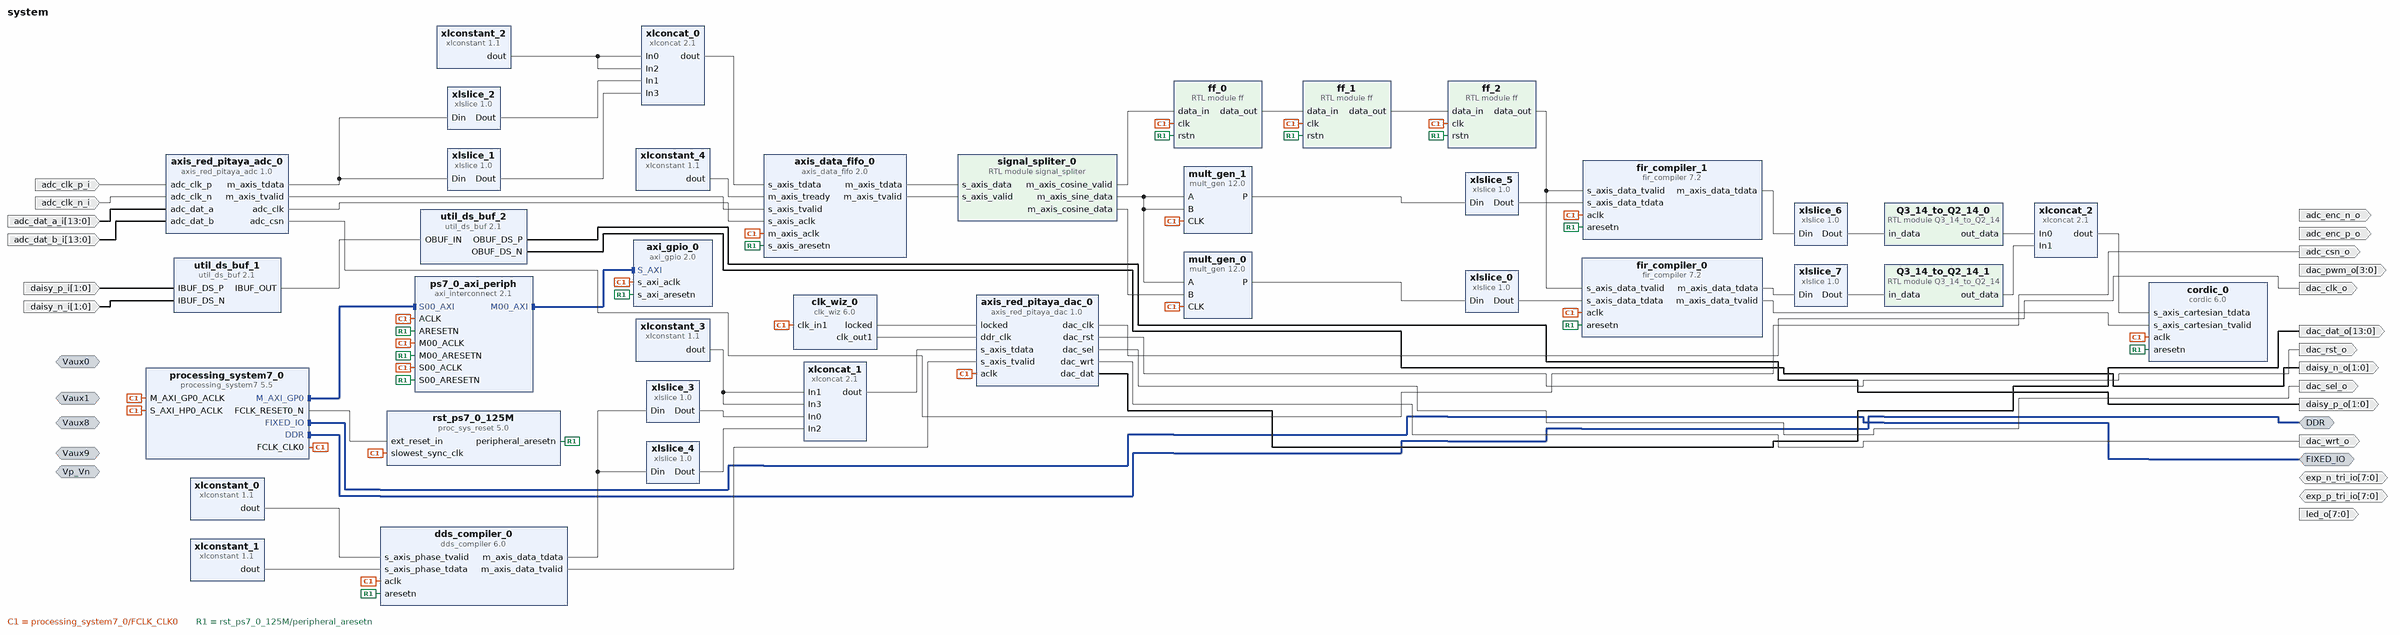
[diagram p0: block diagram of the top level]
# Vivado block design system, xc7z010clg400-1, Vivado 2020.1
create_bd_design system

create_bd_intf_port -mode Slave -vlnv xilinx.com:interface:diff_analog_io_rtl:1.0 Vp_Vn
create_bd_intf_port -mode Slave -vlnv xilinx.com:interface:diff_analog_io_rtl:1.0 Vaux0
create_bd_intf_port -mode Slave -vlnv xilinx.com:interface:diff_analog_io_rtl:1.0 Vaux1
create_bd_intf_port -mode Slave -vlnv xilinx.com:interface:diff_analog_io_rtl:1.0 Vaux9
create_bd_intf_port -mode Slave -vlnv xilinx.com:interface:diff_analog_io_rtl:1.0 Vaux8
create_bd_intf_port -mode Master -vlnv xilinx.com:interface:ddrx_rtl:1.0 DDR
create_bd_intf_port -mode Master -vlnv xilinx.com:display_processing_system7:fixedio_rtl:1.0 FIXED_IO
create_bd_port -dir I -from 13 -to 0 adc_dat_a_i
create_bd_port -dir I -from 13 -to 0 adc_dat_b_i
create_bd_port -dir I adc_clk_p_i
create_bd_port -dir I adc_clk_n_i
create_bd_port -dir O adc_enc_p_o
create_bd_port -dir O adc_enc_n_o
create_bd_port -dir O adc_csn_o
create_bd_port -dir O -from 13 -to 0 dac_dat_o
create_bd_port -dir O dac_clk_o
create_bd_port -dir O dac_rst_o
create_bd_port -dir O dac_sel_o
create_bd_port -dir O dac_wrt_o
create_bd_port -dir O -from 3 -to 0 dac_pwm_o
create_bd_port -dir IO -from 7 -to 0 exp_p_tri_io
create_bd_port -dir IO -from 7 -to 0 exp_n_tri_io
create_bd_port -dir O -from 1 -to 0 daisy_p_o
create_bd_port -dir O -from 1 -to 0 daisy_n_o
create_bd_port -dir I -from 1 -to 0 daisy_p_i
create_bd_port -dir I -from 1 -to 0 daisy_n_i
create_bd_port -dir O -from 7 -to 0 led_o

create_bd_cell -type ip -vlnv xilinx.com:ip:processing_system7:5.5 processing_system7_0
set_property -dict [list \
  CONFIG.PCW_APU_PERIPHERAL_FREQMHZ 666.666666 \
  CONFIG.PCW_ENET0_ENET0_IO {MIO 16 .. 27} \
  CONFIG.PCW_ENET0_GRP_MDIO_ENABLE 1 \
  CONFIG.PCW_ENET0_GRP_MDIO_IO EMIO \
  CONFIG.PCW_ENET0_PERIPHERAL_ENABLE 1 \
  CONFIG.PCW_ENET0_RESET_ENABLE 0 \
  CONFIG.PCW_ENET_RESET_ENABLE 1 \
  CONFIG.PCW_ENET_RESET_SELECT {Share reset pin} \
  CONFIG.PCW_FPGA0_PERIPHERAL_FREQMHZ 125 \
  CONFIG.PCW_FPGA1_PERIPHERAL_FREQMHZ 250 \
  CONFIG.PCW_FPGA3_PERIPHERAL_FREQMHZ 200 \
  CONFIG.PCW_GPIO_MIO_GPIO_ENABLE 1 \
  CONFIG.PCW_GPIO_MIO_GPIO_IO MIO \
  CONFIG.PCW_GPIO_PERIPHERAL_ENABLE 1 \
  CONFIG.PCW_I2C0_GRP_INT_ENABLE 0 \
  CONFIG.PCW_I2C0_I2C0_IO {MIO 50 .. 51} \
  CONFIG.PCW_I2C0_PERIPHERAL_ENABLE 1 \
  CONFIG.PCW_I2C_PERIPHERAL_FREQMHZ 111.111115 \
  CONFIG.PCW_I2C_RESET_ENABLE 1 \
  CONFIG.PCW_I2C_RESET_SELECT {Share reset pin} \
  CONFIG.PCW_IMPORT_BOARD_PRESET cfg/red_pitaya.xml \
  CONFIG.PCW_PRESET_BANK1_VOLTAGE {LVCMOS 2.5V} \
  CONFIG.PCW_QSPI_GRP_SINGLE_SS_ENABLE 1 \
  CONFIG.PCW_QSPI_GRP_SINGLE_SS_IO {MIO 1 .. 6} \
  CONFIG.PCW_QSPI_PERIPHERAL_ENABLE 1 \
  CONFIG.PCW_QSPI_PERIPHERAL_FREQMHZ 125 \
  CONFIG.PCW_QSPI_QSPI_IO {MIO 1 .. 6} \
  CONFIG.PCW_SD0_GRP_CD_ENABLE 1 \
  CONFIG.PCW_SD0_GRP_CD_IO {MIO 46} \
  CONFIG.PCW_SD0_GRP_WP_ENABLE 1 \
  CONFIG.PCW_SD0_GRP_WP_IO {MIO 47} \
  CONFIG.PCW_SD0_PERIPHERAL_ENABLE 1 \
  CONFIG.PCW_SD0_SD0_IO {MIO 40 .. 45} \
  CONFIG.PCW_SDIO_PERIPHERAL_FREQMHZ 100 \
  CONFIG.PCW_SINGLE_QSPI_DATA_MODE x4 \
  CONFIG.PCW_SPI0_PERIPHERAL_ENABLE 1 \
  CONFIG.PCW_SPI0_SPI0_IO EMIO \
  CONFIG.PCW_SPI1_PERIPHERAL_ENABLE 1 \
  CONFIG.PCW_SPI1_SPI1_IO {MIO 10 .. 15} \
  CONFIG.PCW_TTC0_PERIPHERAL_ENABLE 1 \
  CONFIG.PCW_TTC0_TTC0_IO EMIO \
  CONFIG.PCW_UART0_PERIPHERAL_ENABLE 1 \
  CONFIG.PCW_UART0_UART0_IO {MIO 14 .. 15} \
  CONFIG.PCW_UART1_PERIPHERAL_ENABLE 1 \
  CONFIG.PCW_UART1_UART1_IO {MIO 8 .. 9} \
  CONFIG.PCW_UART_PERIPHERAL_FREQMHZ 100 \
  CONFIG.PCW_UIPARAM_DDR_BUS_WIDTH {16 Bit} \
  CONFIG.PCW_UIPARAM_DDR_FREQ_MHZ 533.333333 \
  CONFIG.PCW_UIPARAM_DDR_PARTNO {MT41J256M16 RE-125} \
  CONFIG.PCW_USB0_PERIPHERAL_ENABLE 1 \
  CONFIG.PCW_USB0_RESET_ENABLE 1 \
  CONFIG.PCW_USB0_RESET_IO {MIO 48} \
  CONFIG.PCW_USB0_USB0_IO {MIO 28 .. 39} \
  CONFIG.PCW_USB_RESET_ENABLE 1 \
  CONFIG.PCW_USB_RESET_SELECT {Share reset pin} \
  CONFIG.PCW_USE_S_AXI_HP0 1 \
] [get_bd_cells processing_system7_0]
# 429 more settings of processing_system7_0 are not shown: defaults, MIO pin electricals, DDR timing, and values the tool derives
create_bd_cell -type ip -vlnv xilinx.com:ip:util_ds_buf:2.1 util_ds_buf_1
set_property -dict {CONFIG.C_SIZE 2} [get_bd_cells util_ds_buf_1]
create_bd_cell -type ip -vlnv xilinx.com:ip:util_ds_buf:2.1 util_ds_buf_2
set_property -dict {CONFIG.C_BUF_TYPE OBUFDS CONFIG.C_SIZE 2} [get_bd_cells util_ds_buf_2]
create_bd_cell -type ip -vlnv xilinx.com:ip:axi_gpio:2.0 axi_gpio_0
set_property -dict [list \
  CONFIG.C_ALL_INPUTS_2 1 \
  CONFIG.C_ALL_OUTPUTS 1 \
  CONFIG.C_GPIO_WIDTH 16 \
  CONFIG.C_IS_DUAL 1 \
] [get_bd_cells axi_gpio_0]
create_bd_cell -type ip -vlnv pavel-demin:user:axis_red_pitaya_adc:1.0 axis_red_pitaya_adc_0
create_bd_cell -type ip -vlnv pavel-demin:user:axis_red_pitaya_dac:1.0 axis_red_pitaya_dac_0
create_bd_cell -type ip -vlnv xilinx.com:ip:clk_wiz:6.0 clk_wiz_0
set_property -dict [list \
  CONFIG.CLKIN1_JITTER_PS 80.0 \
  CONFIG.CLKOUT1_JITTER 104.759 \
  CONFIG.CLKOUT1_PHASE_ERROR 96.948 \
  CONFIG.CLKOUT1_REQUESTED_OUT_FREQ 250.000 \
  CONFIG.MMCM_CLKFBOUT_MULT_F 8.000 \
  CONFIG.MMCM_CLKIN1_PERIOD 8.000 \
  CONFIG.MMCM_CLKOUT0_DIVIDE_F 4.000 \
  CONFIG.MMCM_DIVCLK_DIVIDE 1 \
  CONFIG.PRIM_IN_FREQ 125.000 \
  CONFIG.USE_RESET false \
] [get_bd_cells clk_wiz_0]
create_bd_cell -type ip -vlnv xilinx.com:ip:dds_compiler:6.0 dds_compiler_0
set_property -dict [list \
  CONFIG.Amplitude_Mode Full_Range \
  CONFIG.DATA_Has_TLAST Not_Required \
  CONFIG.DDS_Clock_Rate 125 \
  CONFIG.Frequency_Resolution 0.5 \
  CONFIG.Has_ACLKEN false \
  CONFIG.Has_ARESETn true \
  CONFIG.Has_Phase_Out false \
  CONFIG.Latency 7 \
  CONFIG.M_DATA_Has_TUSER Not_Required \
  CONFIG.Noise_Shaping None \
  CONFIG.Output_Frequency1 0 \
  CONFIG.Output_Width 16 \
  CONFIG.PINC1 0 \
  CONFIG.Parameter_Entry Hardware_Parameters \
  CONFIG.PartsPresent Phase_Generator_and_SIN_COS_LUT \
  CONFIG.Phase_Increment Streaming \
  CONFIG.Phase_Width 16 \
  CONFIG.S_PHASE_Has_TUSER Not_Required \
  CONFIG.Spurious_Free_Dynamic_Range 84 \
] [get_bd_cells dds_compiler_0]
create_bd_cell -type ip -vlnv xilinx.com:ip:axi_interconnect:2.1 ps7_0_axi_periph
set_property -dict {CONFIG.NUM_MI 1} [get_bd_cells ps7_0_axi_periph]
create_bd_cell -type ip -vlnv xilinx.com:ip:proc_sys_reset:5.0 rst_ps7_0_125M
create_bd_cell -type ip -vlnv xilinx.com:ip:xlconstant:1.1 xlconstant_0
create_bd_cell -type ip -vlnv xilinx.com:ip:xlconstant:1.1 xlconstant_1
set_property -dict {CONFIG.CONST_VAL 524 CONFIG.CONST_WIDTH 16} [get_bd_cells xlconstant_1]
create_bd_cell -type module -reference signal_spliter signal_spliter_0
create_bd_cell -type ip -vlnv xilinx.com:ip:fir_compiler:7.2 fir_compiler_0
set_property -dict [list \
  CONFIG.Channel_Sequence Basic \
  CONFIG.Clock_Frequency 125 \
  CONFIG.CoefficientVector {-0.036879, 0.014709, 0.012419, 0.010714, 0.009481, 0.008588, 0.007977, 0.007579, 0.007363, 0.007260, 0.007271, 0.007359, 0.007498, 0.007690, 0.007919, 0.008172, 0.008453, 0.008745, 0.009054, 0.009364, 0.009690, 0.010011, 0.010340, 0.010664, 0.010988, 0.011300, 0.011615, 0.011917, 0.012221, 0.012515, 0.012810, 0.013089, 0.013361, 0.013616, 0.013858, 0.014084, 0.014309, 0.014512, 0.014717, 0.014903, 0.015075, 0.015222, 0.015355, 0.015478, 0.015558, 0.015693, 0.015748, 0.015798, 0.015861, 0.015870, 0.015873, 0.015870, 0.015861, 0.015798, 0.015748, 0.015693, 0.015558, 0.015478, 0.015355, 0.015222, 0.015075, 0.014903, 0.014717, 0.014512, 0.014309, 0.014084, 0.013858, 0.013616, 0.013361, 0.013089, 0.012810, 0.012515, 0.012221, 0.011917, 0.011615, 0.011300, 0.010988, 0.010664, 0.010340, 0.010011, 0.009690, 0.009364, 0.009054, 0.008745, 0.008453, 0.008172, 0.007919, 0.007690, 0.007498, 0.007359, 0.007271, 0.007260, 0.007363, 0.007579, 0.007977, 0.008588, 0.009481, 0.010714, 0.012419, 0.014709, -0.036879} \
  CONFIG.Coefficient_Fractional_Bits 19 \
  CONFIG.Coefficient_Sets 1 \
  CONFIG.Coefficient_Sign Signed \
  CONFIG.Coefficient_Structure Inferred \
  CONFIG.Coefficient_Width 16 \
  CONFIG.ColumnConfig 40,11 \
  CONFIG.DATA_Has_TLAST Not_Required \
  CONFIG.Data_Fractional_Bits 14 \
  CONFIG.Data_Sign Signed \
  CONFIG.Data_Width 16 \
  CONFIG.Filter_Architecture Systolic_Multiply_Accumulate \
  CONFIG.Has_ARESETn true \
  CONFIG.M_DATA_Has_TUSER Not_Required \
  CONFIG.Number_Channels 1 \
  CONFIG.Output_Rounding_Mode Full_Precision \
  CONFIG.Output_Width 36 \
  CONFIG.Quantization Quantize_Only \
  CONFIG.S_DATA_Has_TUSER Not_Required \
  CONFIG.Sample_Frequency 125 \
  CONFIG.Select_Pattern All \
] [get_bd_cells fir_compiler_0]
create_bd_cell -type ip -vlnv xilinx.com:ip:xlslice:1.0 xlslice_0
set_property -dict {CONFIG.DIN_FROM 31 CONFIG.DIN_TO 16 CONFIG.DIN_WIDTH 32 CONFIG.DOUT_WIDTH 16} [get_bd_cells xlslice_0]
create_bd_cell -type ip -vlnv xilinx.com:ip:axis_data_fifo:2.0 axis_data_fifo_0
set_property -dict [list \
  CONFIG.FIFO_DEPTH 16 \
  CONFIG.HAS_RD_DATA_COUNT 1 \
  CONFIG.HAS_WR_DATA_COUNT 1 \
  CONFIG.IS_ACLK_ASYNC 1 \
  CONFIG.SYNCHRONIZATION_STAGES 2 \
  CONFIG.TDATA_NUM_BYTES 4 \
] [get_bd_cells axis_data_fifo_0]
create_bd_cell -type ip -vlnv xilinx.com:ip:mult_gen:12.0 mult_gen_0
set_property -dict [list \
  CONFIG.Multiplier_Construction Use_Mults \
  CONFIG.OutputWidthHigh 31 \
  CONFIG.PipeStages 3 \
  CONFIG.PortAType Signed \
  CONFIG.PortAWidth 16 \
  CONFIG.PortBType Signed \
  CONFIG.PortBWidth 16 \
  CONFIG.Use_Custom_Output_Width true \
] [get_bd_cells mult_gen_0]
create_bd_cell -type module -reference ff ff_0
create_bd_cell -type module -reference ff ff_1
create_bd_cell -type module -reference ff ff_2
create_bd_cell -type ip -vlnv xilinx.com:ip:xlslice:1.0 xlslice_1
set_property -dict {CONFIG.DIN_FROM 29 CONFIG.DIN_TO 16 CONFIG.DOUT_WIDTH 14} [get_bd_cells xlslice_1]
create_bd_cell -type ip -vlnv xilinx.com:ip:xlslice:1.0 xlslice_2
set_property -dict {CONFIG.DIN_FROM 13 CONFIG.DIN_TO 0 CONFIG.DOUT_WIDTH 14} [get_bd_cells xlslice_2]
create_bd_cell -type ip -vlnv xilinx.com:ip:xlconstant:1.1 xlconstant_2
set_property -dict {CONFIG.CONST_VAL 0 CONFIG.CONST_WIDTH 2} [get_bd_cells xlconstant_2]
create_bd_cell -type ip -vlnv xilinx.com:ip:xlconcat:2.1 xlconcat_0
set_property -dict [list \
  CONFIG.IN0_WIDTH 2 \
  CONFIG.IN1_WIDTH 14 \
  CONFIG.IN2_WIDTH 2 \
  CONFIG.IN3_WIDTH 14 \
  CONFIG.NUM_PORTS 4 \
] [get_bd_cells xlconcat_0]
create_bd_cell -type ip -vlnv xilinx.com:ip:xlslice:1.0 xlslice_3
set_property -dict {CONFIG.DIN_FROM 15 CONFIG.DIN_TO 2 CONFIG.DOUT_WIDTH 14} [get_bd_cells xlslice_3]
create_bd_cell -type ip -vlnv xilinx.com:ip:xlconstant:1.1 xlconstant_3
set_property -dict {CONFIG.CONST_VAL 0 CONFIG.CONST_WIDTH 2} [get_bd_cells xlconstant_3]
create_bd_cell -type ip -vlnv xilinx.com:ip:xlslice:1.0 xlslice_4
set_property -dict {CONFIG.DIN_FROM 31 CONFIG.DIN_TO 18 CONFIG.DOUT_WIDTH 14} [get_bd_cells xlslice_4]
create_bd_cell -type ip -vlnv xilinx.com:ip:xlconcat:2.1 xlconcat_1
set_property -dict [list \
  CONFIG.IN0_WIDTH 14 \
  CONFIG.IN1_WIDTH 2 \
  CONFIG.IN2_WIDTH 14 \
  CONFIG.IN3_WIDTH 2 \
  CONFIG.NUM_PORTS 4 \
] [get_bd_cells xlconcat_1]
create_bd_cell -type ip -vlnv xilinx.com:ip:mult_gen:12.0 mult_gen_1
set_property -dict [list \
  CONFIG.Multiplier_Construction Use_Mults \
  CONFIG.OutputWidthHigh 31 \
  CONFIG.PipeStages 3 \
  CONFIG.PortAType Signed \
  CONFIG.PortAWidth 16 \
  CONFIG.PortBType Signed \
  CONFIG.PortBWidth 16 \
  CONFIG.Use_Custom_Output_Width true \
] [get_bd_cells mult_gen_1]
create_bd_cell -type ip -vlnv xilinx.com:ip:fir_compiler:7.2 fir_compiler_1
set_property -dict [list \
  CONFIG.Channel_Sequence Basic \
  CONFIG.Clock_Frequency 125 \
  CONFIG.CoefficientVector {-0.036879, 0.014709, 0.012419, 0.010714, 0.009481, 0.008588, 0.007977, 0.007579, 0.007363, 0.007260, 0.007271, 0.007359, 0.007498, 0.007690, 0.007919, 0.008172, 0.008453, 0.008745, 0.009054, 0.009364, 0.009690, 0.010011, 0.010340, 0.010664, 0.010988, 0.011300, 0.011615, 0.011917, 0.012221, 0.012515, 0.012810, 0.013089, 0.013361, 0.013616, 0.013858, 0.014084, 0.014309, 0.014512, 0.014717, 0.014903, 0.015075, 0.015222, 0.015355, 0.015478, 0.015558, 0.015693, 0.015748, 0.015798, 0.015861, 0.015870, 0.015873, 0.015870, 0.015861, 0.015798, 0.015748, 0.015693, 0.015558, 0.015478, 0.015355, 0.015222, 0.015075, 0.014903, 0.014717, 0.014512, 0.014309, 0.014084, 0.013858, 0.013616, 0.013361, 0.013089, 0.012810, 0.012515, 0.012221, 0.011917, 0.011615, 0.011300, 0.010988, 0.010664, 0.010340, 0.010011, 0.009690, 0.009364, 0.009054, 0.008745, 0.008453, 0.008172, 0.007919, 0.007690, 0.007498, 0.007359, 0.007271, 0.007260, 0.007363, 0.007579, 0.007977, 0.008588, 0.009481, 0.010714, 0.012419, 0.014709, -0.036879} \
  CONFIG.Coefficient_Fractional_Bits 19 \
  CONFIG.Coefficient_Sets 1 \
  CONFIG.Coefficient_Sign Signed \
  CONFIG.Coefficient_Structure Inferred \
  CONFIG.Coefficient_Width 16 \
  CONFIG.ColumnConfig 40,11 \
  CONFIG.DATA_Has_TLAST Not_Required \
  CONFIG.Data_Fractional_Bits 14 \
  CONFIG.Data_Sign Signed \
  CONFIG.Data_Width 16 \
  CONFIG.Filter_Architecture Systolic_Multiply_Accumulate \
  CONFIG.Has_ARESETn true \
  CONFIG.M_DATA_Has_TUSER Not_Required \
  CONFIG.Number_Channels 1 \
  CONFIG.Output_Rounding_Mode Full_Precision \
  CONFIG.Output_Width 36 \
  CONFIG.Quantization Quantize_Only \
  CONFIG.S_DATA_Has_TUSER Not_Required \
  CONFIG.Sample_Frequency 125 \
  CONFIG.Select_Pattern All \
] [get_bd_cells fir_compiler_1]
create_bd_cell -type ip -vlnv xilinx.com:ip:xlslice:1.0 xlslice_5
set_property -dict {CONFIG.DIN_FROM 31 CONFIG.DIN_TO 16 CONFIG.DIN_WIDTH 32 CONFIG.DOUT_WIDTH 16} [get_bd_cells xlslice_5]
create_bd_cell -type module -reference Q3_14_to_Q2_14 Q3_14_to_Q2_14_0
create_bd_cell -type module -reference Q3_14_to_Q2_14 Q3_14_to_Q2_14_1
create_bd_cell -type ip -vlnv xilinx.com:ip:cordic:6.0 cordic_0
set_property -dict [list \
  CONFIG.ARESETN true \
  CONFIG.Data_Format SignedFraction \
  CONFIG.Functional_Selection Arc_Tan \
  CONFIG.Input_Width 16 \
] [get_bd_cells cordic_0]
create_bd_cell -type ip -vlnv xilinx.com:ip:xlslice:1.0 xlslice_6
set_property -dict {CONFIG.DIN_FROM 35 CONFIG.DIN_TO 19 CONFIG.DIN_WIDTH 36 CONFIG.DOUT_WIDTH 17} [get_bd_cells xlslice_6]
create_bd_cell -type ip -vlnv xilinx.com:ip:xlslice:1.0 xlslice_7
set_property -dict {CONFIG.DIN_FROM 35 CONFIG.DIN_TO 19 CONFIG.DIN_WIDTH 36 CONFIG.DOUT_WIDTH 17} [get_bd_cells xlslice_7]
create_bd_cell -type ip -vlnv xilinx.com:ip:xlconcat:2.1 xlconcat_2
set_property -dict {CONFIG.IN0_WIDTH 16 CONFIG.IN1_WIDTH 16} [get_bd_cells xlconcat_2]
create_bd_cell -type ip -vlnv xilinx.com:ip:xlconstant:1.1 xlconstant_4

# ---- connections ----

connect_bd_intf_net [get_bd_intf_ports FIXED_IO] [get_bd_intf_pins processing_system7_0/FIXED_IO]
connect_bd_intf_net [get_bd_intf_pins ps7_0_axi_periph/M00_AXI] [get_bd_intf_pins axi_gpio_0/S_AXI]
connect_bd_intf_net [get_bd_intf_pins processing_system7_0/M_AXI_GP0] [get_bd_intf_pins ps7_0_axi_periph/S00_AXI]
connect_bd_intf_net [get_bd_intf_ports DDR] [get_bd_intf_pins processing_system7_0/DDR]
connect_bd_net [get_bd_ports daisy_p_i] [get_bd_pins util_ds_buf_1/IBUF_DS_P]
connect_bd_net [get_bd_ports daisy_n_i] [get_bd_pins util_ds_buf_1/IBUF_DS_N]
connect_bd_net [get_bd_pins util_ds_buf_2/OBUF_DS_P] [get_bd_ports daisy_p_o]
connect_bd_net [get_bd_pins util_ds_buf_2/OBUF_DS_N] [get_bd_ports daisy_n_o]
connect_bd_net [get_bd_pins util_ds_buf_1/IBUF_OUT] [get_bd_pins util_ds_buf_2/OBUF_IN]
connect_bd_net [get_bd_pins processing_system7_0/FCLK_CLK0] \
  [get_bd_pins processing_system7_0/M_AXI_GP0_ACLK] [get_bd_pins processing_system7_0/S_AXI_HP0_ACLK] \
  [get_bd_pins ps7_0_axi_periph/S00_ACLK] [get_bd_pins rst_ps7_0_125M/slowest_sync_clk] [get_bd_pins axi_gpio_0/s_axi_aclk] \
  [get_bd_pins ps7_0_axi_periph/M00_ACLK] [get_bd_pins ps7_0_axi_periph/ACLK] [get_bd_pins axis_red_pitaya_dac_0/aclk] \
  [get_bd_pins clk_wiz_0/clk_in1] [get_bd_pins dds_compiler_0/aclk] [get_bd_pins fir_compiler_0/aclk] \
  [get_bd_pins axis_data_fifo_0/m_axis_aclk] [get_bd_pins mult_gen_0/CLK] [get_bd_pins ff_0/clk] [get_bd_pins ff_1/clk] \
  [get_bd_pins ff_2/clk] [get_bd_pins mult_gen_1/CLK] [get_bd_pins fir_compiler_1/aclk] [get_bd_pins cordic_0/aclk]
connect_bd_net [get_bd_ports adc_clk_p_i] [get_bd_pins axis_red_pitaya_adc_0/adc_clk_p]
connect_bd_net [get_bd_ports adc_clk_n_i] [get_bd_pins axis_red_pitaya_adc_0/adc_clk_n]
connect_bd_net [get_bd_ports adc_dat_a_i] [get_bd_pins axis_red_pitaya_adc_0/adc_dat_a]
connect_bd_net [get_bd_ports adc_dat_b_i] [get_bd_pins axis_red_pitaya_adc_0/adc_dat_b]
connect_bd_net [get_bd_pins axis_red_pitaya_adc_0/adc_csn] [get_bd_ports adc_csn_o]
connect_bd_net [get_bd_pins axis_red_pitaya_dac_0/dac_clk] [get_bd_ports dac_clk_o]
connect_bd_net [get_bd_pins axis_red_pitaya_dac_0/dac_rst] [get_bd_ports dac_rst_o]
connect_bd_net [get_bd_pins axis_red_pitaya_dac_0/dac_sel] [get_bd_ports dac_sel_o]
connect_bd_net [get_bd_pins axis_red_pitaya_dac_0/dac_wrt] [get_bd_ports dac_wrt_o]
connect_bd_net [get_bd_pins axis_red_pitaya_dac_0/dac_dat] [get_bd_ports dac_dat_o]
connect_bd_net [get_bd_pins clk_wiz_0/locked] [get_bd_pins axis_red_pitaya_dac_0/locked]
connect_bd_net [get_bd_pins clk_wiz_0/clk_out1] [get_bd_pins axis_red_pitaya_dac_0/ddr_clk]
connect_bd_net [get_bd_pins processing_system7_0/FCLK_RESET0_N] [get_bd_pins rst_ps7_0_125M/ext_reset_in]
connect_bd_net [get_bd_pins rst_ps7_0_125M/peripheral_aresetn] \
  [get_bd_pins ps7_0_axi_periph/S00_ARESETN] [get_bd_pins axi_gpio_0/s_axi_aresetn] \
  [get_bd_pins ps7_0_axi_periph/M00_ARESETN] [get_bd_pins ps7_0_axi_periph/ARESETN] [get_bd_pins dds_compiler_0/aresetn] \
  [get_bd_pins fir_compiler_0/aresetn] [get_bd_pins axis_data_fifo_0/s_axis_aresetn] [get_bd_pins ff_0/rstn] \
  [get_bd_pins ff_1/rstn] [get_bd_pins ff_2/rstn] [get_bd_pins fir_compiler_1/aresetn] [get_bd_pins cordic_0/aresetn]
connect_bd_net [get_bd_pins xlconstant_0/dout] [get_bd_pins dds_compiler_0/s_axis_phase_tvalid]
connect_bd_net [get_bd_pins xlconstant_1/dout] [get_bd_pins dds_compiler_0/s_axis_phase_tdata]
connect_bd_net [get_bd_pins signal_spliter_0/m_axis_sine_data] [get_bd_pins mult_gen_0/A] [get_bd_pins mult_gen_1/A] [get_bd_pins mult_gen_1/B]
connect_bd_net [get_bd_pins signal_spliter_0/m_axis_cosine_data] [get_bd_pins mult_gen_0/B]
connect_bd_net [get_bd_pins signal_spliter_0/m_axis_cosine_valid] [get_bd_pins ff_0/data_in]
connect_bd_net [get_bd_pins xlslice_0/Dout] [get_bd_pins fir_compiler_0/s_axis_data_tdata]
connect_bd_net [get_bd_pins axis_red_pitaya_adc_0/m_axis_tvalid] [get_bd_pins axis_data_fifo_0/s_axis_tvalid]
connect_bd_net [get_bd_pins axis_red_pitaya_adc_0/adc_clk] [get_bd_pins axis_data_fifo_0/s_axis_aclk]
connect_bd_net [get_bd_pins ff_0/data_out] [get_bd_pins ff_1/data_in]
connect_bd_net [get_bd_pins ff_1/data_out] [get_bd_pins ff_2/data_in]
connect_bd_net [get_bd_pins xlconstant_2/dout] [get_bd_pins xlconcat_0/In0] [get_bd_pins xlconcat_0/In2]
connect_bd_net [get_bd_pins xlslice_2/Dout] [get_bd_pins xlconcat_0/In1]
connect_bd_net [get_bd_pins xlslice_1/Dout] [get_bd_pins xlconcat_0/In3]
connect_bd_net [get_bd_pins xlconcat_0/dout] [get_bd_pins axis_data_fifo_0/s_axis_tdata]
connect_bd_net [get_bd_pins axis_red_pitaya_adc_0/m_axis_tdata] [get_bd_pins xlslice_2/Din] [get_bd_pins xlslice_1/Din]
connect_bd_net [get_bd_pins xlslice_3/Dout] [get_bd_pins xlconcat_1/In0]
connect_bd_net [get_bd_pins xlslice_4/Dout] [get_bd_pins xlconcat_1/In2]
connect_bd_net [get_bd_pins xlconstant_3/dout] [get_bd_pins xlconcat_1/In1] [get_bd_pins xlconcat_1/In3]
connect_bd_net [get_bd_pins xlconcat_1/dout] [get_bd_pins axis_red_pitaya_dac_0/s_axis_tdata]
connect_bd_net [get_bd_pins dds_compiler_0/m_axis_data_tdata] [get_bd_pins xlslice_3/Din] [get_bd_pins xlslice_4/Din]
connect_bd_net [get_bd_pins dds_compiler_0/m_axis_data_tvalid] [get_bd_pins axis_red_pitaya_dac_0/s_axis_tvalid]
connect_bd_net [get_bd_pins mult_gen_0/P] [get_bd_pins xlslice_0/Din]
connect_bd_net [get_bd_pins ff_2/data_out] [get_bd_pins fir_compiler_0/s_axis_data_tvalid] [get_bd_pins fir_compiler_1/s_axis_data_tvalid]
connect_bd_net [get_bd_pins mult_gen_1/P] [get_bd_pins xlslice_5/Din]
connect_bd_net [get_bd_pins xlslice_5/Dout] [get_bd_pins fir_compiler_1/s_axis_data_tdata]
connect_bd_net [get_bd_pins xlslice_6/Dout] [get_bd_pins Q3_14_to_Q2_14_0/in_data]
connect_bd_net [get_bd_pins xlslice_7/Dout] [get_bd_pins Q3_14_to_Q2_14_1/in_data]
connect_bd_net [get_bd_pins Q3_14_to_Q2_14_0/out_data] [get_bd_pins xlconcat_2/In0]
connect_bd_net [get_bd_pins Q3_14_to_Q2_14_1/out_data] [get_bd_pins xlconcat_2/In1]
connect_bd_net [get_bd_pins xlconcat_2/dout] [get_bd_pins cordic_0/s_axis_cartesian_tdata]
connect_bd_net [get_bd_pins fir_compiler_0/m_axis_data_tvalid] [get_bd_pins cordic_0/s_axis_cartesian_tvalid]
connect_bd_net [get_bd_pins fir_compiler_1/m_axis_data_tdata] [get_bd_pins xlslice_6/Din]
connect_bd_net [get_bd_pins fir_compiler_0/m_axis_data_tdata] [get_bd_pins xlslice_7/Din]
connect_bd_net [get_bd_pins axis_data_fifo_0/m_axis_tdata] [get_bd_pins signal_spliter_0/s_axis_data]
connect_bd_net [get_bd_pins axis_data_fifo_0/m_axis_tvalid] [get_bd_pins signal_spliter_0/s_axis_valid]
connect_bd_net [get_bd_pins xlconstant_4/dout] [get_bd_pins axis_data_fifo_0/m_axis_tready]

# ---- address map ----
assign_bd_address -offset 0x41200000 -range 4K -target_address_space [get_bd_addr_spaces processing_system7_0/Data] [get_bd_addr_segs axi_gpio_0/S_AXI/Reg]

validate_bd_design
save_bd_design
